# Altium schematic sheet CameraConn.SchDoc
size 431 x 279 mm; Organization: ORGANIZATION; Address1: ADDRESS 1; Address2: ADDRESS 2; Address3: ADDRESS 3; Address4: ADDRESS 4; Revision: -; SheetNumber: 1; SheetTotal: 5; ENG_APP_DATE: --/--/--; DSN_APP_DATE: --/--/--; CHK_APP_DATE: --/--/--
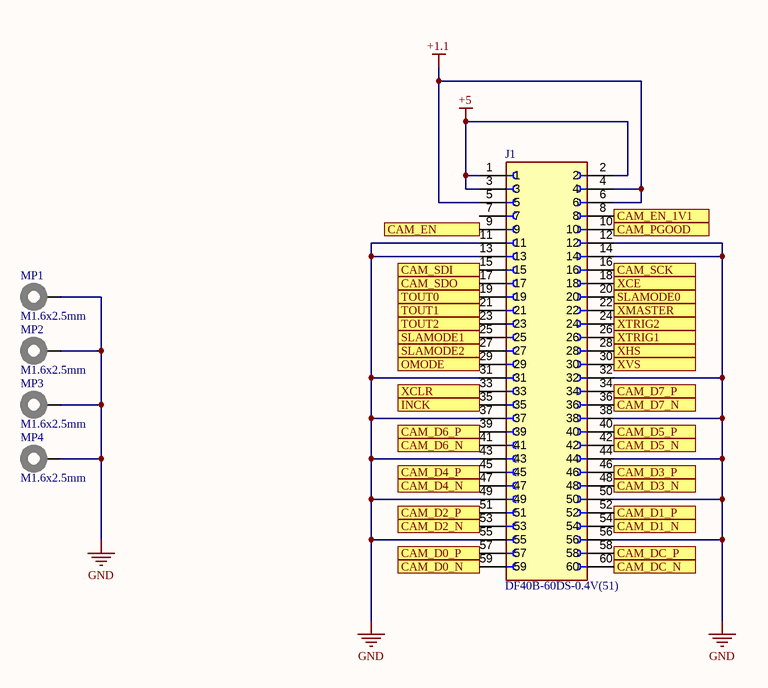
[diagram p0: CameraConn.SchDoc]

## Parts
J1  DF40B-60DS-0.4V(51)  [HRS_DF40B-60DS-0.4V(51)]
MP1  M1.6x2.5mm  [97730256330]
MP2  M1.6x2.5mm  [97730256330]
MP3  M1.6x2.5mm  [97730256330]
MP4  M1.6x2.5mm  [97730256330]

## Ports
CAM_D0_N, CAM_D0_P, CAM_D1_N, CAM_D1_P, CAM_D2_N, CAM_D2_P, CAM_D3_N, CAM_D3_P, CAM_D4_N, CAM_D4_P, CAM_D5_N, CAM_D5_P, CAM_D6_N, CAM_D6_P, CAM_D7_N, CAM_D7_P, CAM_DC_N, CAM_DC_P, CAM_EN, CAM_EN_1V1, CAM_PGOOD, CAM_SCK, CAM_SDI, CAM_SDO, INCK, OMODE, SLAMODE0, SLAMODE1, SLAMODE2, TOUT0, TOUT1, TOUT2, XCE, XCLR, XHS, XMASTER, XTRIG1, XTRIG2, XVS

## Nets
+1.1: J1.4 J1.5 J1.6
+5: J1.1 J1.2 J1.3
GND: J1.11 J1.12 J1.13 J1.14 J1.31 J1.32 J1.37 J1.38 J1.43 J1.44 J1.49 J1.50 J1.55 J1.56 MP1.1 MP2.1 MP3.1 MP4.1
CAM_D0_N: J1.59 ; port CAM_D0_N
CAM_D0_P: J1.57 ; port CAM_D0_P
CAM_D1_N: J1.54 ; port CAM_D1_N
CAM_D1_P: J1.52 ; port CAM_D1_P
CAM_D2_N: J1.53 ; port CAM_D2_N
CAM_D2_P: J1.51 ; port CAM_D2_P
CAM_D3_N: J1.48 ; port CAM_D3_N
CAM_D3_P: J1.46 ; port CAM_D3_P
CAM_D4_N: J1.47 ; port CAM_D4_N
CAM_D4_P: J1.45 ; port CAM_D4_P
CAM_D5_N: J1.42 ; port CAM_D5_N
CAM_D5_P: J1.40 ; port CAM_D5_P
CAM_D6_N: J1.41 ; port CAM_D6_N
CAM_D6_P: J1.39 ; port CAM_D6_P
CAM_D7_N: J1.36 ; port CAM_D7_N
CAM_D7_P: J1.34 ; port CAM_D7_P
CAM_DC_N: J1.60 ; port CAM_DC_N
CAM_DC_P: J1.58 ; port CAM_DC_P
CAM_EN: J1.9 ; port CAM_EN
CAM_EN_1V1: J1.8 ; port CAM_EN_1V1
CAM_PGOOD: J1.10 ; port CAM_PGOOD
CAM_SCK: J1.16 ; port CAM_SCK
CAM_SDI: J1.15 ; port CAM_SDI
CAM_SDO: J1.17 ; port CAM_SDO
INCK: J1.35 ; port INCK
OMODE: J1.29 ; port OMODE
SLAMODE0: J1.20 ; port SLAMODE0
SLAMODE1: J1.25 ; port SLAMODE1
SLAMODE2: J1.27 ; port SLAMODE2
TOUT0: J1.19 ; port TOUT0
TOUT1: J1.21 ; port TOUT1
TOUT2: J1.23 ; port TOUT2
XCE: J1.18 ; port XCE
XCLR: J1.33 ; port XCLR
XHS: J1.28 ; port XHS
XMASTER: J1.22 ; port XMASTER
XTRIG1: J1.26 ; port XTRIG1
XTRIG2: J1.24 ; port XTRIG2
XVS: J1.30 ; port XVS

Not connected (* = marked no-connect by the designer): J1 7

## Notes on the sheet
- DWG. NO.
- REV.
- SHT.
- REVISION
- DESCRIPTION
- DATE
- APPROVED
- ENG:
- APPROVALS
- PROJECT
- DSN:
- CHK:
- REFERENCE DOCUMENTS
- PROJECT REVISION:
- TITLE
- SimulaVR
- DOCUMENT REVISION:
- DESIGN ITEM:
- BOM:
- FAB DWG:
- PCB DWG:
- ASSY DWG:
- SCALE:
- SIZE
- B
- CAGE CODE
- FILE NAME
- DWG NO.
- SHEET
- OF
- REV

## Library data of the parts
J1 = CMP-013-000000-1: MF: {'manufacturer': u'Hirose Electric Co Ltd'}; Availability: Unavailable; Package: None; Price: None; Source: DF40B-60DS-0.4V(51).SchLib; Value: *; Design Item ID: DF40B-60DS-0.4V(51); MP: DF40B-60DS-0.4V(51)
MP1-MP4 = 97730256330: WA-SMSI SMT Steel Spacer, internal Thread Bottom closed, OD 3.3mm, M1.6x2.5mm; Manufacturer: Wurth Elektronik; Inner Thread Length: 1.5mm; Surface: Tin; Thread: M1.6; ComponentLink1Description: Manufacturer; ComponentLink1URL: http://www.we-online.de; ComponentLink2Description: Datasheet; ComponentLink2URL: https://www.we-online.com/catalog/datasheet/97730256330.pdf; Mounting Technology: SMT; Packaging: Bulk; Manufacturer Part Number: 97730256330; Inner Diameter: -; Length: 2.5mm; Operating Temperature: -55 to +150degC; Outer Diameter: 3.3mm; Published Date: April 2020; Material: Steel